# EasyEDA Pro project MA3050.eprj

# Schematic Schematic1
Create Date: 2024-05-30; Page Name: P1; Project Name: MA3050; Schematic Name: Schematic1; Update Date: 2024-06-02; Company: Just for fun; Drawed: GodGnidoc; Page Size: A4; Version: V1.2
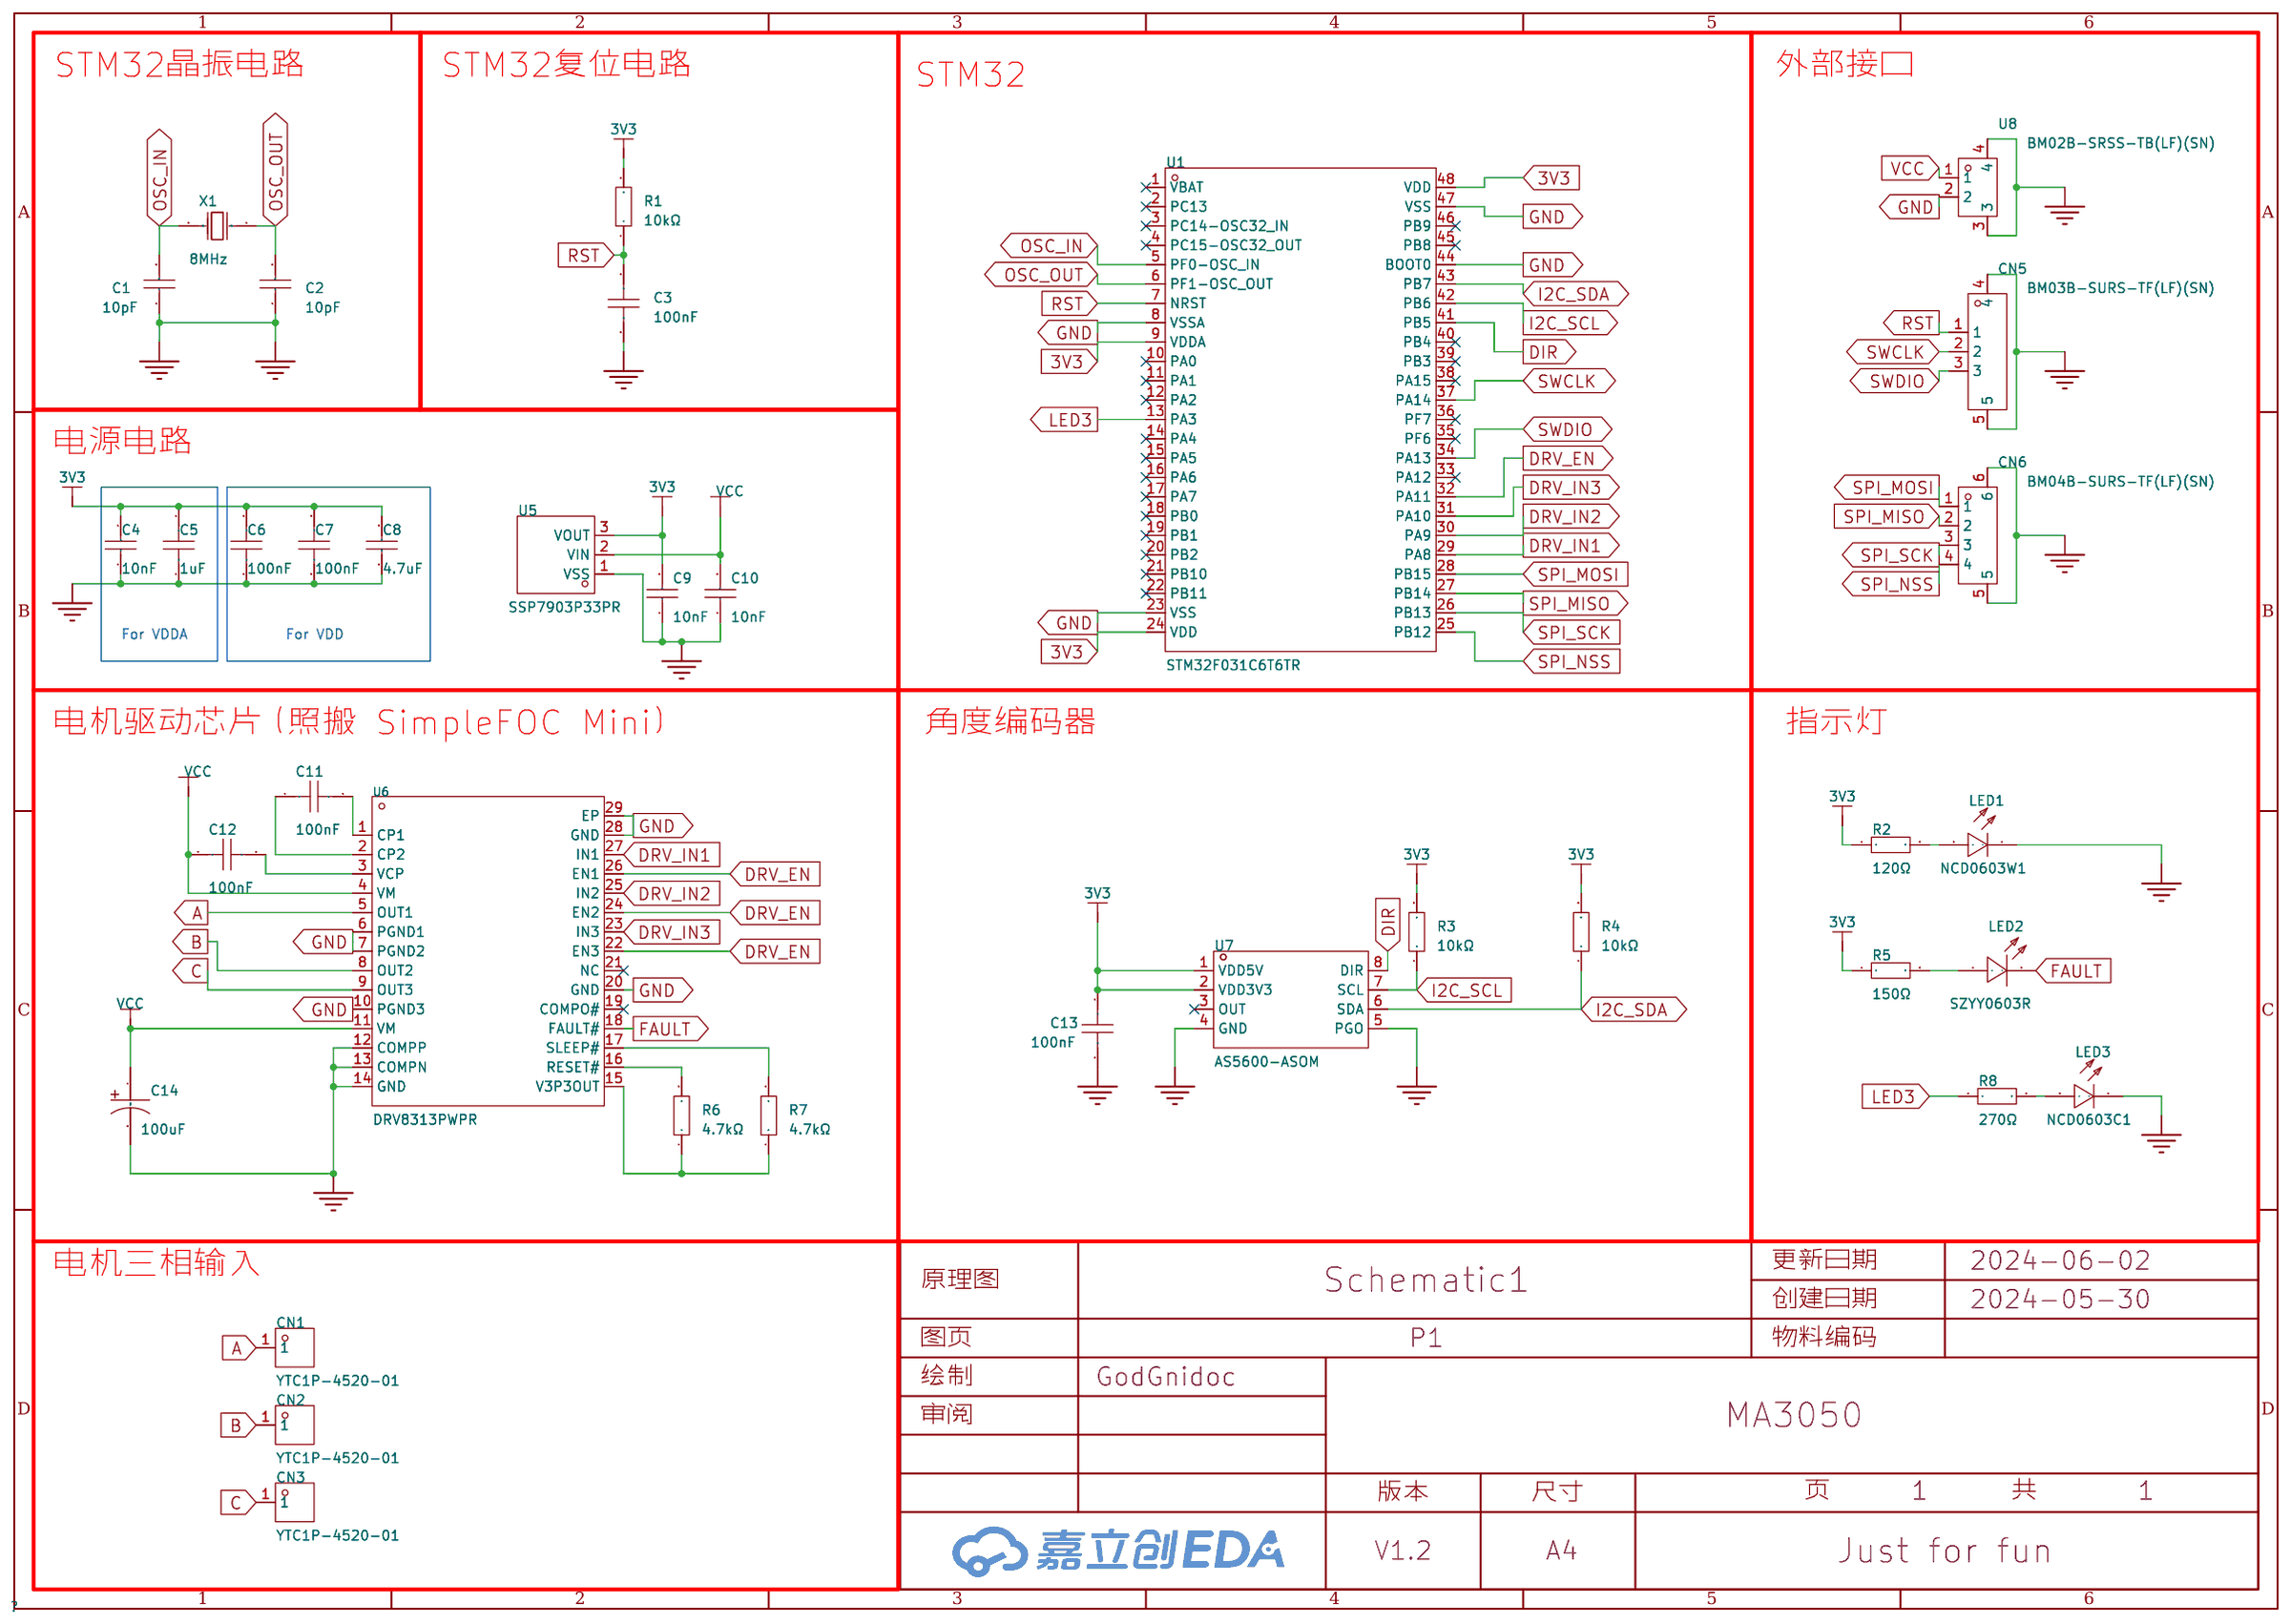
[diagram p0: schematic sheet]

## Parts
C1  10pF  [C0603]
C2  10pF  [C0603]
C3  100nF  [C0603]
C4  10nF  [C0603]
C5  1uF  [C0603]
C6  100nF  [C0603]
C7  100nF  [C0603]
C8  4.7uF  [C0603]
C9  10nF  [C0603]
C10  10nF  [C0603]
C11  100nF  [C0603]
C12  100nF  [C0603]
C13  100nF  [C0603]
C14  100uF  [CAP-SMD_BD6.3-L6.6-W6.6-FD]
CN1  YTC1P-4520-01  [TESTPOINT-SMD_BD2.0_YTC1P-4520-01]
CN2  YTC1P-4520-01  [TESTPOINT-SMD_BD2.0_YTC1P-4520-01]
CN3  YTC1P-4520-01  [TESTPOINT-SMD_BD2.0_YTC1P-4520-01]
CN5  BM03B-SURS-TF(LF)(SN)  [CONN-SMD_BM03B-SURS-TF]
CN6  BM04B-SURS-TF(LF)(SN)  [CONN-SMD_BM04B-SURS-TF-LF-SN]
LED1  NCD0603W1  [LED0603-RD]
LED2  SZYY0603R  [LED0603-R-RD]
LED3  NCD0603C1  [LED0603-RD]
R1  10kΩ  [R0603]
R2  120Ω  [R0603]
R3  10kΩ  [R0603]
R4  10kΩ  [R0603]
R5  150Ω  [R0603]
R6  4.7kΩ  [R0603]
R7  4.7kΩ  [R0603]
R8  270Ω  [R0603]
U1  STM32F031C6T6TR  [LQFP-48_L7.0-W7.0-P0.50-LS9.0-TL]
U5  SSP7903P33PR  [SOT-89-3_L4.5-W2.5-P1.50-LS4.1-BR]
U6  DRV8313PWPR  [HTSSOP-28_L9.8-W4.5-P0.65-LS6.6-BL-EP]
U7  AS5600-ASOM  [SOIC-8_L5.0-W4.0-P1.27-LS6.0-BL]
U8  BM02B-SRSS-TB(LF)(SN)  [CONN-TH_BM02B-SRSS-TB-LF-SN]
X1  8MHz  [CRYSTAL-SMD_L5.0-W3.2]

## Library data of the parts
C1 C2 = CL10C100JB8NNNC: 容值:10pF;精度:±5%;额定电压:50V;材质(温度系数):C0G;; LCSC Part Name: 10pF ±5% 50V; Supplier Part: C1634; Manufacturer: SAMSUNG(三星); Supplier Footprint: 0603; JLCPCB Part Class: 基础库; Datasheet: https://atta.szlcsc.com/upload/public/pdf/source/20160218/1457707763339.pdf; Supplier: LCSC; Tolerance: ±5%; Voltage Rated: 50V; Temperature Coefficient: C0G; Check: true
C3 C6 C7 C11-C13 = CL10B104KB8NNNC: 容值:100nF;精度:±10%;额定电压:50V;材质(温度系数):X7R;; LCSC Part Name: 100nF ±10% 50V; Supplier Part: C1591; Manufacturer: SAMSUNG(三星); Supplier Footprint: 0603; JLCPCB Part Class: Extended Part; Datasheet: https://atta.szlcsc.com/upload/public/pdf/source/20160218/1457707763339.pdf; Supplier: LCSC; Tolerance: ±10%; Voltage Rated: 50V; Temperature Coefficient: X7R; Check: true
C4 C9 C10 = CC0603KRX7R9BB103: 容值:10nF;精度:±10%;额定电压:50V;材质(温度系数):X7R;; LCSC Part Name: 10nF ±10% 50V; Supplier Part: C100042; Manufacturer: YAGEO(国巨); Supplier Footprint: 0603; JLCPCB Part Class: 扩展库; Datasheet: https://atta.szlcsc.com/upload/public/pdf/source/20181008/C309510_22F155564471FAF6A489F7D68F34234E.pdf; Supplier: LCSC; Tolerance: ±10%; Voltage Rated: 50V; Temperature Coefficient: X7R; Check: true
C5 = CL10A105KB8NNNC: 容值:1uF;精度:±10%;额定电压:50V;材质(温度系数):X5R;; LCSC Part Name: 1uF ±10% 50V; Supplier Part: C15849; Manufacturer: SAMSUNG(三星); Supplier Footprint: 0603; JLCPCB Part Class: 基础库; Datasheet: https://atta.szlcsc.com/upload/public/pdf/source/20160218/1457707763339.pdf; Supplier: LCSC; Tolerance: ±10%; Voltage Rated: 50V; Temperature Coefficient: X5R; Check: true
C8 = CL10A475KO8NNNC: 容值:4.7uF;精度:±10%;额定电压:16V;材质(温度系数):X5R;; LCSC Part Name: 4.7uF ±10% 16V; Supplier Part: C19666; Manufacturer: SAMSUNG(三星); Supplier Footprint: 0603; JLCPCB Part Class: 基础库; Datasheet: https://atta.szlcsc.com/upload/public/pdf/source/20160218/1457707763339.pdf; Supplier: LCSC; Tolerance: ±10%; Voltage Rated: 16V; Temperature Coefficient: X5R; Check: true
C14 = VT1V101M-CRE77: 容值:100uF;精度:±20%;额定电压:35V;纹波电流:-;等效串联电阻:-;; LCSC Part Name: 100uF ±20% 35V; Supplier Part: C294520; Manufacturer: VT(首科); Supplier Footprint: SMD,D6.3xL7.7mm; JLCPCB Part Class: 扩展库; Datasheet: https://atta.szlcsc.com/upload/public/pdf/source/20181029/C324063_620585B2DB5C8ABB183828EAB4CD59C7.pdf; Supplier: LCSC; Tolerance: ±20%; Rated Voltage: 35V; φD: 6.3mm; L: 7.7mm; Lifetime @ Temp: 1000hrs@105℃; Operating Temperature: -40℃~+105℃; Check: true
CN1-CN3 = YTC1P-4520-01: 类型:弹簧顶针(POGO PIN);PIN位数:单PIN位;全长/全高:6.5mm;额定电流:2.5A;额定电压:12V;触头材质:黄铜;触头镀层:金;; LCSC Part Name: POGO PIN弹簧顶针 贴片连接器; Supplier Part: C5221294; Manufacturer: YIYUAN(怡远); JLCPCB Part Class: 扩展库; Datasheet: https://atta.szlcsc.com/upload/public/pdf/source/20221031/BD070516233C1C93A35D01CFB419D0D5.pdf; Supplier: LCSC; Type: 弹簧顶针(POGO PIN); Number of Pins: 单PIN位; Overall Length/Height: 6.5mm; Rated Current: 2.5A; Rated Voltage: 12V; Contact Material: 黄铜; Contact Plating: 金; Check: true
CN5 = BM03B-SURS-TF(LF)(SN): 插针结构:1x3P;间距:0.8mm;安装方式:立贴;参考系列:-;总PIN数:3P;排数:1;每排PIN数:3;行距:-;额定电流:200mA;触头材质:铜合金;触头镀层:锡;工作温度范围:-25℃~+85℃;; LCSC Part Name: 1x3P 间距:0.8mm 立贴; Supplier Part: C594379; Manufacturer: JST; Supplier Footprint: SMD,P=0.8mm; JLCPCB Part Class: 扩展库; Datasheet: https://atta.szlcsc.com/upload/public/pdf/source/20211104/F9E1F8CA9D999D7845259FE213F9F750.pdf; Supplier: LCSC; Pins Structure: 1x3P; Pitch: 0.8mm; Mounting Style: 立贴; Number of Pins: 3P; Number of Rows: 1; Number of PINs Per Row: 3; Current Rating (Max): 200mA; Contact Material: 铜合金; Contact Plating: 锡; Operating Temperature Range: -25℃~+85℃
CN6 = BM04B-SURS-TF(LF)(SN): 插针结构:1x4P;间距:0.8mm;安装方式:立贴;参考系列:-;总PIN数:4P;排数:1;每排PIN数:4;行距:-;额定电流:200mA;触头材质:铜合金;触头镀层:锡;工作温度范围:-25℃~+85℃;; LCSC Part Name: 1x4P 间距:0.8mm 立贴; Supplier Part: C495551; Manufacturer: JST; Supplier Footprint: SMD,P=0.8mm; JLCPCB Part Class: Extended Part; Datasheet: https://atta.szlcsc.com/upload/public/pdf/source/20200407/C495551_4ACF452D9BF553EDABEE027727395083.pdf; Supplier: LCSC; Pins Structure: 1x4P; Pitch: 0.8mm; Mounting Style: 立贴; Number of Pins: 4P; Number of Rows: 1; Number of PINs Per Row: 4; Current Rating (Max): 200mA; Contact Material: 铜合金; Contact Plating: 锡; Operating Temperature Range: -25℃~+85℃
LED1 = NCD0603W1: 发光颜色:白色;正向电压(VF):2.6V~3.6V;功率:72mW;正向电流:5mA;透镜颜色:雾状黄透镜;发光强度:200mcd~300mcd;发光角度:130°;工作温度:-30℃~+85℃;; Supplier Part: C84265; Manufacturer: 国星光电; Supplier Footprint: 0603; JLCPCB Part Class: 扩展库; Datasheet: https://atta.szlcsc.com/upload/public/pdf/source/20200820/C84265_479E6193713348A548E5CD6D9278BF16.pdf; Supplier: LCSC; Emitted Color: 白色; Forward Voltage (VF): 2.6V~3.6V; Power Dissipation: 72mW; Forward Current: 5mA; Lens Color: 雾状黄透镜; Luminous Intensity: 200mcd~300mcd; Viewing Angle: 130°; Operating Temperature: -30℃~+85℃; Check: true
LED2 = SZYY0603R: 发光颜色:红色;功率:40mW;正向电流:20mA;主波长:615nm~630nm;二极管配置:-;透镜颜色:无色透明透镜;色温:-;发光角度:120°;载带方式:-;工作温度:-40℃~+85℃;; LCSC Part Name: 红灯; Supplier Part: C434419; Manufacturer: yongyu(永裕光电); Supplier Footprint: 0603; JLCPCB Part Class: 扩展库; Datasheet: https://atta.szlcsc.com/upload/public/pdf/source/20191204/C434419_0B955C1F73FF88449D9A795B6FF49070.pdf; Supplier: LCSC; Emitted Color: 红色; Power Dissipation: 40mW; Forward Current: 20mA; Dominant Wavelength: 615nm~630nm; Peak Wavelength: 645nm; Lens Color: 无色透明透镜; Viewing Angle: 120°; Operating Temperature: -40℃~+85℃; Check: true
LED3 = NCD0603C1: 发光颜色:黄绿色;正向电压(VF):1.6V~2.6V;功率:65mW;正向电流:5mA;主波长:565nm~578nm;透镜颜色:无色透明透镜;发光强度:5mcd~13mcd;发光角度:140°;工作温度:-30℃~+85℃;; Supplier Part: C84264; Manufacturer: 国星光电; Supplier Footprint: 0603; JLCPCB Part Class: 扩展库; Datasheet: https://atta.szlcsc.com/upload/public/pdf/source/20200820/C84264_94B2FEF0C4ADFC9200EBC3AD62A401B4.pdf; Supplier: LCSC; Emitted Color: 黄绿色; Forward Voltage (VF): 1.6V~2.6V; Power Dissipation: 65mW; Forward Current: 5mA; Dominant Wavelength: 565nm~578nm; Lens Color: 无色透明透镜; Luminous Intensity: 5mcd~13mcd; Viewing Angle: 140°; Operating Temperature: -30℃~+85℃; Check: true
R1 R3 R4 = 0603WAF1002T5E: 电阻类型:厚膜电阻;阻值:10kΩ;精度:±1%;功率:100mW;最大工作电压:75V;温度系数:±100ppm/℃;; LCSC Part Name: 厚膜电阻 10kΩ ±1% 100mW; Supplier Part: C25804; Manufacturer: UNI-ROYAL(厚声); Supplier Footprint: 0603; JLCPCB Part Class: 基础库; Datasheet: https://atta.szlcsc.com/upload/public/pdf/source/20200306/C422600_1E6D84923E4A46A82E41ADD87F860B5C.pdf; Supplier: LCSC; Type: 厚膜电阻; Tolerance: ±1%; Power(Watts): 100mW; Overload Voltage (Max): 75V; Temperature Coefficient: ±100ppm/℃; Operating Temperature Range: -55℃~+155℃; Check: true
R2 = 0603WAF1200T5E: 电阻类型:厚膜电阻;阻值:120Ω;精度:±1%;功率:100mW;最大工作电压:75V;温度系数:±100ppm/℃;; LCSC Part Name: 120Ω ±1% 100mW 厚膜电阻; Supplier Part: C22787; Manufacturer: UNI-ROYAL(厚声); Supplier Footprint: 0603; JLCPCB Part Class: 基础库; Datasheet: https://atta.szlcsc.com/upload/public/pdf/source/20200306/C422600_1E6D84923E4A46A82E41ADD87F860B5C.pdf; Supplier: LCSC; Type: 厚膜电阻; Tolerance: ±1%; Power(Watts): 100mW; Overload Voltage (Max): 75V; Temperature Coefficient: ±100ppm/℃; Operating Temperature Range: -55℃~+155℃; Check: true
R5 = 0603WAF1500T5E: 电阻类型:厚膜电阻;阻值:150Ω;精度:±1%;功率:100mW;最大工作电压:75V;温度系数:±100ppm/℃;; LCSC Part Name: 150Ω ±1% 100mW 厚膜电阻; Supplier Part: C22808; Manufacturer: UNI-ROYAL(厚声); Supplier Footprint: 0603; JLCPCB Part Class: 基础库; Datasheet: https://atta.szlcsc.com/upload/public/pdf/source/20200306/C422600_1E6D84923E4A46A82E41ADD87F860B5C.pdf; Supplier: LCSC; Type: 厚膜电阻; Tolerance: ±1%; Power(Watts): 100mW; Overload Voltage (Max): 75V; Temperature Coefficient: ±100ppm/℃; Operating Temperature Range: -55℃~+155℃; Check: true
R6 R7 = 0603WAF4701T5E: 电阻类型:厚膜电阻;阻值:4.7kΩ;精度:±1%;功率:100mW;最大工作电压:75V;温度系数:±100ppm/℃;; LCSC Part Name: 4.7kΩ ±1% 100mW 厚膜电阻; Supplier Part: C23162; Manufacturer: UNI-ROYAL(厚声); Supplier Footprint: 0603; JLCPCB Part Class: 基础库; Datasheet: https://atta.szlcsc.com/upload/public/pdf/source/20200306/C422600_1E6D84923E4A46A82E41ADD87F860B5C.pdf; Supplier: LCSC; Type: 厚膜电阻; Tolerance: ±1%; Power(Watts): 100mW; Overload Voltage (Max): 75V; Temperature Coefficient: ±100ppm/℃; Operating Temperature Range: -55℃~+155℃; Check: true
R8 = 0603WAF2700T5E: 电阻类型:厚膜电阻;阻值:270Ω;精度:±1%;功率:100mW;最大工作电压:75V;温度系数:±100ppm/℃;; LCSC Part Name: 270Ω ±1% 100mW 厚膜电阻; Supplier Part: C22966; Manufacturer: UNI-ROYAL(厚声); Supplier Footprint: 0603; JLCPCB Part Class: 基础库; Datasheet: https://atta.szlcsc.com/upload/public/pdf/source/20200306/C422600_1E6D84923E4A46A82E41ADD87F860B5C.pdf; Supplier: LCSC; Type: 厚膜电阻; Tolerance: ±1%; Power(Watts): 100mW; Overload Voltage (Max): 75V; Temperature Coefficient: ±100ppm/℃; Operating Temperature Range: -55℃~+155℃; Check: true
U1 = STM32F031C6T6TR: CPU内核:CM0;程序存储容量:32KB;RAM总容量:4KB;GPIO端口数量:39;工作电压范围:2V~3.6V;CPU最大主频:48MHz;程序存储器类型:FLASH;; Supplier Part: C329281; Manufacturer: ST(意法半导体); Supplier Footprint: LQFP-48(7x7); JLCPCB Part Class: 扩展库; Datasheet: https://atta.szlcsc.com/upload/public/pdf/source/20200115/C329281_BA1E970E2AF70B7E7E25D04A5194356F.pdf; Supplier: LCSC; CPU Core: CM0; Program Storage Size: 32KB; RAM Size: 4KB; GPIO Ports Number: 39; Operating Voltage Range: 2V~3.6V; CPU Maximum Speed: 48MHz; Program Memory Type: FLASH; Operating Temperature Range: -40℃~+85℃; ADC (Bit): 12bit; Peripheral/Function: DMA；PWM; Watchdog: 有; Infrared Data Association: 有; Low-Voltage Detect: 有; Direct Memory Access: 有; Internal Oscillator: 有; Check: true
U5 = SSP7903P33PR: 最大输入电压:40V;输出电压:3.3V;最大输出电流:1A;电源纹波抑制比(PSRR):73.2dB@(10Hz);输出极性:正极;; Supplier Part: C2965586; Manufacturer: Siproin(上海矽朋); Supplier Footprint: SOT-89-3; JLCPCB Part Class: 扩展库; Datasheet: https://atta.szlcsc.com/upload/public/pdf/source/20231026/C9DC5668D914F4F12A37EC04B80DC6E1.pdf; Supplier: LCSC; Maximum Input Voltage: 40V; Output Voltage: 3.3V; MAX Output Current: 1A; Power Supply Rejection Ratio (PSRR): 73.2dB@(10Hz); Dropout Voltage: 20mV; standby current: 1.6uA; Operating Temperature: -40℃~+85℃; Output Polarity: 正极; Number of Outputs: 1; Check: true
U6 = DRV8313PWPR: 驱动电机类型:无刷直流BLDC;电源电压:8V~60V;输出电流:-;接口:并行;; LCSC Part Name: 无刷直流BLDC电机驱动芯片 60V; Supplier Part: C92482; Manufacturer: TI(德州仪器); Supplier Footprint: HTSSOP-28-EP-4.5mm; JLCPCB Part Class: 扩展库; Datasheet: https://www.ti.com/cn/lit/gpn/drv8313; Supplier: LCSC; Drive motor type: 无刷直流BLDC; Supply Voltage: 8V~60V; Interface: 并行; Operating Temperature: -40℃~+150℃@(Tj); Check: true
U7 = AS5600-ASOM: 旋转角度范围:0°~360°;; Supplier Part: C79815; Manufacturer: ams(艾迈斯半导体); Supplier Footprint: SOIC-8; JLCPCB Part Class: 扩展库; Datasheet: https://atta.szlcsc.com/upload/public/pdf/source/20161027/1477535527192.pdf; Supplier: LCSC; Supply Voltage: 5V；3.3V; Rotation Angle: 0°~360°; Check: true
U8 = BM02B-SRSS-TB(LF)(SN): 插针结构:1x2P;间距:1mm;安装方式:立贴;参考系列:SH;总PIN数:2P;排数:1;每排PIN数:2;行距:-;额定电流:1A;触头材质:铜合金;触头镀层:锡;工作温度范围:-25℃~+85℃;; LCSC Part Name: 1x2P 间距:1mm 立贴 系列:SH; Supplier Part: C160388; Manufacturer: JST; Supplier Footprint: SMD,P=1mm; JLCPCB Part Class: Extended Part; Datasheet: https://atta.szlcsc.com/upload/public/pdf/source/20181008/C268118_5C0FE2784716D1E5DD0A36233D1E1F34.pdf; Supplier: LCSC; Pins Structure: 1x2P; Pitch: 1mm; Mounting Style: 立贴; Reference Series: SH; Number of Pins: 2P; Number of Rows: 1; Number of PINs Per Row: 2; Current Rating (Max): 1A; Contact Material: 铜合金; Contact Plating: 锡; Operating Temperature Range: -25℃~+85℃; Rated Voltage (Max): 50V; Plastic Material: PA; Flame Retardant Rating: UL94V-0; Z-Height of the Board: 4.25mm; X-Length of Bottom Edge on Board (Spacing Line): 4mm; Y-Width of Bottom Edge on Board: 3.6mm
X1 = X50328MSB2GI: 晶振类型:贴片晶振;频率:8MHz;常温频差:±10ppm;外接负载电容:20pF;频率稳定度(全温):±20ppm;; LCSC Part Name: 8MHz ±10ppm 20pF YSX530GA; Supplier Part: C115962; Manufacturer: YXC(扬兴晶振); Supplier Footprint: SMD5032; JLCPCB Part Class: 基础库; Datasheet: https://atta.szlcsc.com/upload/public/pdf/source/20240329/44922B0AF7B60E58E9B66993B6077277.pdf; Supplier: LCSC; Crystal Type: 贴片晶振; Normal temperature Frequency Tolerance: ±10ppm; External load capacitor: 20pF; Frequency Stability(Full temperature range): ±20ppm; Operating Temperature: -40℃~+85℃; Check: true

## Nets
3V3: C4.2 C5.2 C6.2 C7.2 C8.2 C9.2 C13.1 R1.2 R2.1 R3.2 R4.2 R5.1 U1.9(VDDA) U1.24(VDD) U1.48(VDD) U5.3(VOUT) U7.1(VDD5V) U7.2(VDD3V3)
GND: C1.1 C2.1 C3.1 C4.1 C5.1 C6.1 C7.1 C8.1 C9.1 C10.1 C13.2 C14.2 CN5.4 CN5.5 CN6.5 CN6.6 LED1.1(-) LED3.1(-) U1.8(VSSA) U1.23(VSS) U1.44(BOOT0) U1.47(VSS) U5.1(VSS) U6.6(PGND1) U6.7(PGND2) U6.10(PGND3) U6.12(COMPP) U6.13(COMPN) U6.14(GND) U6.20(GND) U6.28(GND) U6.29(EP) U7.4(GND) U7.5(PGO) U8.2 U8.3 U8.4
VCC: C10.2 C12.1 C14.1 U5.2(VIN) U6.4(VM) U6.11(VM) U8.1
A: CN1.1 U6.5(OUT1)
B: CN2.1 U6.8(OUT2)
C: CN3.1 U6.9(OUT3)
DIR: U1.41(PB5) U7.8(DIR)
DRV_EN: U1.32(PA11) U6.22(EN3) U6.24(EN2) U6.26(EN1)
DRV_IN1: U1.29(PA8) U6.27(IN1)
DRV_IN2: U1.30(PA9) U6.25(IN2)
DRV_IN3: U1.31(PA10) U6.23(IN3)
FAULT: LED2.2(-) U6.18(FAULT#)
I2C_SCL: R3.1 U1.42(PB6) U7.7(SCL)
I2C_SDA: R4.1 U1.43(PB7) U7.6(SDA)
LED3: R8.1 U1.13(PA3)
OSC_IN: C1.2 U1.5(PF0-OSC_IN) X1.2(OSC2)
OSC_OUT: C2.2 U1.6(PF1-OSC_OUT) X1.1(OSC1)
RST: C3.2 CN5.1 R1.1 U1.7(NRST)
SPI_MISO: CN6.2 U1.27(PB14)
SPI_MOSI: CN6.1 U1.28(PB15)
SPI_NSS: CN6.4 U1.25(PB12)
SPI_SCK: CN6.3 U1.26(PB13)
SWCLK: CN5.2 U1.37(PA14)
SWDIO: CN5.3 U1.34(PA13)
$1N1736: C11.2 U6.1(CP1)
$1N1740: C11.1 U6.2(CP2)
$1N1864: C12.2 U6.3(VCP)
$1N2389: R6.1 R7.1 U6.15(V3P3OUT)
$1N2553: R6.2 U6.16(RESET#)
$1N2568: R7.2 U6.17(SLEEP#)
$1N10555: LED1.2(+) R2.2
$1N10742: LED2.1(+) R5.2
$1N10752: LED3.2(+) R8.2

Not connected (* = marked no-connect by the designer): U1 1(VBAT)* 2(PC13)* 3(PC14-OSC32_IN)* 4(PC15-OSC32_OUT)* 10(PA0)* 11(PA1)* 12(PA2)* 14(PA4)* 15(PA5)* 16(PA6)* 17(PA7)* 18(PB0)* 19(PB1)* 20(PB2)* 21(PB10)* 22(PB11)* 33(PA12)* 35(PF6)* 36(PF7)* 38(PA15)* 39(PB3)* 40(PB4)* 45(PB8)* 46(PB9)*; U6 19(COMPO#)* 21(NC)*; U7 3(OUT)*

## Notes on the sheet
- STM32晶振电路
- STM32复位电路
- STM32
- 外部接口
- 电源电路
- For VDDA
- For VDD
- 电机驱动芯片（照搬 SimpleFOC Mini）
- 角度编码器
- 指示灯
- 电机三相输入

# Board PCB1
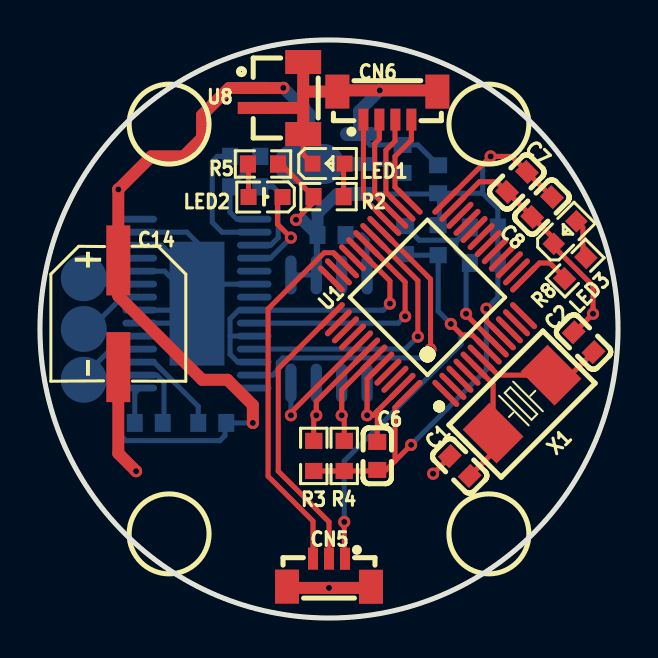
[diagram p1: board, top side]
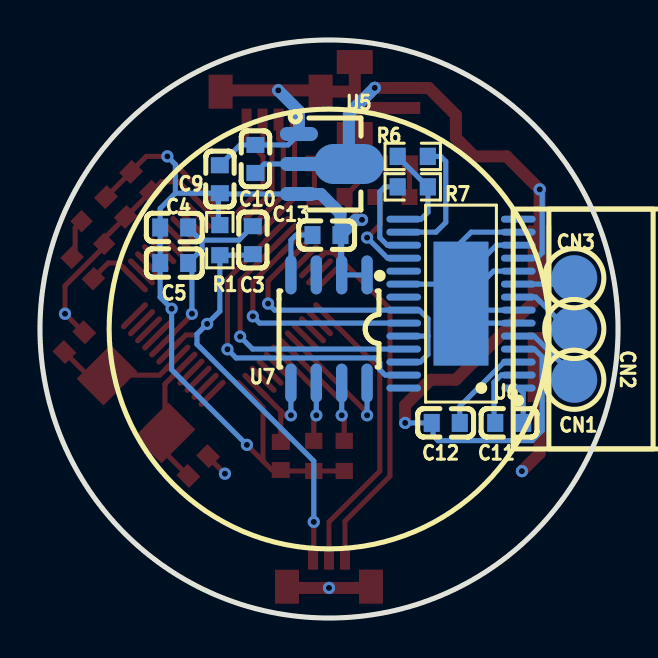
[diagram p2: board, bottom side, seen from below]

Outline 28.92 x 28.92 mm; copper layers: Top Layer, Bottom Layer. Coordinates in mm from the lower left corner of the outline.
Outline path: circle c14.46,14.46 r14.46
Stack: Top Layer 0.035mm / Dielectric1 1.51mm FR4 er 4.5 / Bottom Layer 0.035mm

## Design rules (mm)
net OSC_IN: DP1
net OSC_OUT: DP1
template: JLCPCB Capability(Two Layers Board)
spacing copperThickness1oz (default): track to track 0.102, other pairs 0.152 to 0.3
spacing copperThickness2oz: track to track 0.203, other pairs 0.152 to 0.3
track width copperThickness1oz (default): min 0.127, default 0.254, max 2.54
track width copperThickness2oz: min 0.203, default 0.254, max 2.54
differential pair differentialPair (default): width min 0.127, default 0.254, max 2.54; gap min 0.152, default 0.152
via viaSize (default): diameter min 0.5, default 0.61, max 10; hole min 0.3, default 0.305, max 6.3

## Placement (name value [footprint] x y rotation side)
C1  10pF  [C0603]  21 7.6 315 top
C2  10pF  [C0603]  27.2 13.8 315 top
C3  100nF  [C0603]  18.27 18.91 270 bottom
C4  10nF  [C0603]  22.21 19.54 0 bottom
C5  1uF  [C0603]  22.21 17.76 0 bottom
C6  100nF  [C0603]  16.87 8.11 270 top
C7  100nF  [C0603]  23.86 21.82 45 top
C8  4.7uF  [C0603]  25.12 20.56 45 top
C9  10nF  [C0603]  19.92 21.95 270 bottom
C10  10nF  [C0603]  18.14 22.97 270 bottom
C11  100nF  [C0603]  5.44 9.76 180 bottom
C12  100nF  [C0603]  8.62 9.76 180 bottom
C13  100nF  [C0603]  14.59 19.16 0 bottom
C14  100uF  [CAP-SMD_BD6.3-L6.6-W6.6-FD]  3.92 15.22 270 top
CN1  YTC1P-4520-01  [TESTPOINT-SMD_BD2.0_YTC1P-4520-01]  2.19 11.92 0 bottom
CN2  YTC1P-4520-01  [TESTPOINT-SMD_BD2.0_YTC1P-4520-01]  2.19 14.46 0 bottom
CN3  YTC1P-4520-01  [TESTPOINT-SMD_BD2.0_YTC1P-4520-01]  2.19 17 0 bottom
CN5  BM03B-SURS-TF(LF)(SN)  [CONN-SMD_BM03B-SURS-TF]  14.46 2.27 0 top
CN6  BM04B-SURS-TF(LF)(SN)  [CONN-SMD_BM04B-SURS-TF-LF-SN]  17.38 25.64 0 top
LED1  NCD0603W1  [LED0603-RD]  14.44 22.73 0 top
LED2  SZYY0603R  [LED0603-R-RD]  11.28 21.06 180 top
LED3  NCD0603C1  [LED0603-RD]  26.27 19.29 45 top
R1  10kΩ  [R0603]  19.92 18.91 90 bottom
R2  120Ω  [R0603]  14.44 21.08 0 top
R3  10kΩ  [R0603]  13.7 8.11 270 top
R4  10kΩ  [R0603]  15.22 8.11 270 top
R5  150Ω  [R0603]  11.16 22.72 180 top
R6  4.7kΩ  [R0603]  10.27 23.1 180 bottom
R7  4.7kΩ  [R0603]  10.27 21.57 0 bottom
R8  270Ω  [R0603]  26.78 17.51 45 top
U1  STM32F031C6T6TR  [lqfp-48_l7.0-w7.0-p0.50-ls9.0-tl]  19.39 16.05 135 top
U5  SSP7903P33PR  [SOT-89-3_L4.5-W2.5-P1.50-LS4.1-BR]  14.71 22.72 0 bottom
U6  DRV8313PWPR  [HTSSOP-28_L9.8-W4.5-P0.65-LS6.6-BL-EP]  7.86 15.73 90 bottom
U7  AS5600-ASOM  [SOIC-8_L5.0-W4.0-P1.27-LS6.0-BL]  14.46 14.46 0 bottom
U8  BM02B-SRSS-TB(LF)(SN)  [CONN-TH_BM02B-SRSS-TB-LF-SN]  11.92 26.02 90 top
X1  8MHz  [CRYSTAL-SMD_L5.0-W3.2]  24.12 10.7 225 top

## Footprints (pads in the part's own frame, mm; a bottom-side part is the same pattern mirrored in y, then rotated)
C0603
  rect 0.8x0.9 smd: 1(-0.7,0) 2(0.7,0)
CAP-SMD_BD6.3-L6.6-W6.6-FD
  rect 3.5x1.2 smd: 1(-2.67,0) 2(2.67,0)
CONN-SMD_BM03B-SURS-TF
  rect 0.5x1.1 smd: 1(0.799,0.699) 2(-0.001,0.702) 3(-0.8,0.702)
  rect 1.2x1.7 smd: 4(-2.1,-0.699) 5(2.1,-0.702)
CONN-SMD_BM04B-SURS-TF-LF-SN
  rect 0.5x1.1 smd: 1(-1.2,-0.699) 2(-0.4,-0.702) 3(0.401,-0.702) 4(1.201,-0.702)
  rect 1.2x1.7 smd: 5(2.501,0.699) 6(-2.501,0.702)
CONN-TH_BM02B-SRSS-TB-LF-SN
  rect 0.6x1.55 smd: 1(0.502,1.25) 2(-0.498,1.25)
  rect 1.2x1.8 smd: 3(1.8,-1.25) 4(-1.8,-1.25)
CRYSTAL-SMD_L5.0-W3.2
  rect 1.9x2.4 smd: 1(-2.05,0) 2(2.05,0)
HTSSOP-28_L9.8-W4.5-P0.65-LS6.6-BL-EP
  oval 0.343x1.732 smd: 1(-4.225,-2.866) 2(-3.575,-2.866) 3(-2.925,-2.866) 4(-2.275,-2.866) 5(-1.625,-2.866) 6(-0.975,-2.866) 7(-0.325,-2.866) 8(0.325,-2.866) 9(0.975,-2.866) 10(1.625,-2.866) 11(2.275,-2.866) 12(2.925,-2.866) 13(3.575,-2.866) 14(4.225,-2.866) 15(4.225,2.866) 16(3.575,2.866) 17(2.925,2.866) 18(2.275,2.866) 19(1.625,2.866) 20(0.975,2.866) 21(0.325,2.866) 22(-0.325,2.866) 23(-0.975,2.866) 24(-1.625,2.866) 25(-2.275,2.866) 26(-2.925,2.866) 27(-3.575,2.866) 28(-4.225,2.866)
  rect 6.2x2.75 smd: 29(0,0)
LED0603-R-RD
  rect 0.8x0.8 smd: 1(0.851,0) 2(-0.851,0)
LED0603-RD
  rect 0.8x0.8 smd: 1(-0.799,0) 2(0.799,0)
lqfp-48_l7.0-w7.0-p0.50-ls9.0-tl
  oval 1.8x0.28 smd: 1(-4.05,2.75) 2(-4.05,2.25) 3(-4.05,1.75) 4(-4.05,1.25) 5(-4.05,0.75) 6(-4.05,0.25) 7(-4.05,-0.25) 8(-4.05,-0.75) 9(-4.05,-1.25) 10(-4.05,-1.75) 11(-4.05,-2.25) 12(-4.05,-2.75) 25(4.05,-2.75) 26(4.05,-2.25) 27(4.05,-1.75) 28(4.05,-1.25) 29(4.05,-0.75) 30(4.05,-0.25) 31(4.05,0.25) 32(4.05,0.75) 33(4.05,1.25) 34(4.05,1.75) 35(4.05,2.25) 36(4.05,2.75)
  oval 0.28x1.8 smd: 13(-2.75,-4.05) 14(-2.25,-4.05) 15(-1.75,-4.05) 16(-1.25,-4.05) 17(-0.75,-4.05) 18(-0.25,-4.05) 19(0.25,-4.05) 20(0.75,-4.05) 21(1.25,-4.05) 22(1.75,-4.05) 23(2.25,-4.05) 24(2.75,-4.05) 37(2.75,4.05) 38(2.25,4.05) 39(1.75,4.05) 40(1.25,4.05) 41(0.75,4.05) 42(0.25,4.05) 43(-0.25,4.05) 44(-0.75,4.05) 45(-1.25,4.05) 46(-1.75,4.05) 47(-2.25,4.05) 48(-2.75,4.05)
R0603
  rect 0.806x0.864 smd: 1(-0.753,0) 2(0.753,0)
SOIC-8_L5.0-W4.0-P1.27-LS6.0-BL
  oval 0.569x1.95 smd: 1(-1.905,-2.705) 2(-0.635,-2.705) 3(0.635,-2.705) 4(1.905,-2.705) 5(1.905,2.705) 6(0.635,2.705) 7(-0.635,2.705) 8(-1.905,2.705)
SOT-89-3_L4.5-W2.5-P1.50-LS4.1-BR
  oval 1.9x0.7 smd: 1(1.25,-1.501) 3(1.25,1.501)
  oval 3.5x2 smd: 2(-1.25,0)
  oval 2.1x0.7 smd: 2(1.151,0)
TESTPOINT-SMD_BD2.0_YTC1P-4520-01
  round 2.3 smd: 1(0,0)

## Nets
As in the schematic.

Pads without a net: U1 1 2 3 4 10 11 12 14 15 16 17 18 19 20 21 22 33 35 36 38 39 40 45 46; U6 19 21; U7 3

## Via types
v1: diameter 0.61, hole 0.305, Top Layer to Bottom Layer, 24 vias

## Routing (per net, layer and track width the routed paths; a pad name or vN(x,y) marks a point on that pad's centre or on a via; arc(x,y) is an arc through that point)
3V3: length 56.8
  Top Layer w0.254: R5.1 12.05,22.72 R2.1 13.68,20.8 v1(12.81,19.92) ; v1(22.33,15.48) 22.33,14.87 U1.9 ; R3.2 R4.2 16.82,7.36 C6.2 17.32,7.41 17.76,7.86 ; 17.76,7.86 17.76,10.53 U1.48 ; 17.76,7.86 v1(18.57,8.66) ; U1.24 v1(22.55,23.1) 23.6,23.1 24.36,22.34 C7.2 C8.2
  Bottom Layer w0.254: U5.3 19.88,21.21 C9.2 ; 22.15,21.25 C9.2 ; 22.15,21.25 22.15,22.69 v1(22.55,23.1) ; 22.15,21.25 22.91,20.49 C4.2 C5.2 22.91,16.05 v1(22.33,15.48) 22.33,12.43 v1(18.57,8.66) ; C9.2 19.99,21.18 19.99,19.66 R1.2 ; U7.2 U7.1 ; U7.2 13.89,17.17 C13.1 13.83,19.1 U7.2
  Bottom Layer w0.6: U5.3 14.86,21.21 13.89,20.24 C13.1 13.12,19.92 v1(12.81,19.92)
GND: length 88.9
  Top Layer w0.254: 16.87,10.35 C6.1 ; 16.87,10.35 U1.47 ; 16.87,10.35 16.66,10.14 v1(16.37,10.14) 16.37,11.96 U1.44 ; U1.8 21.32,15.17 v1(21.32,15.22) ; U1.23 21.98,21.83 22.84,21.83 23.34,21.32 C7.1 C8.1 25.71,18.99 LED3.1 25.71,18.58 27.67,16.62 v1(27.67,15.22) 26.74,14.3 C2.1 ; 13.64,22.86 13.51,22.86 13.17,23.2 ; v1(19.67,7.22) 20.51,8.06 C1.1 ; U8.4 13.17,23.33
  Top Layer w0.6: CN5.4 12.42,1.51 v1(14.46,1.51) 16.5,1.51 CN5.5 ; U8.4 13.17,25.65 ; 13.17,25.65 13.04,25.52 U8.2 ; 13.17,25.65 13.17,26.34 ; C14.2 3.92,8.24 v1(4.81,7.35) ; U8.3 13.17,26.34 ; 13.17,26.34 CN6.6 14.94,26.4 v1(17,26.4) 19.82,26.4 CN6.5
  Bottom Layer w0.254: 7.86,16.88 U6.29 ; 7.86,16.88 7.86,18.8 7.35,19.31 U6.13 ; 7.86,16.88 6.08,18.66 U6.12 ; U6.29 8.83,16.71 U6.20 ; U6.29 6.23,17.36 U6.10 ; U6.29 7.53,15.41 ; U6.6 6.88,14.76 7.36,15.23 7.53,15.41 ; C13.2 16.11,19.16 16.37,18.91 U7.4 ; U5.1 16.51,23.67 C10.1 18.91,23.67 C9.1 ; 20.87,18.91 C4.1 ; 20.87,18.91 18.97,18.91 C3.1 ; 20.87,18.91 20.81,18.84 20.81,18.46 C5.1 21.32,17.57 v1(21.32,15.22) ; U6.7 7.53,15.41 ; U7.5 v1(16.37,10.14)
  Bottom Layer w0.6: v1(17,26.4) 15.96,25.36 U5.1
VCC: length 50.4
  Top Layer w0.6: v1(10.65,9.76) 10.65,10.65 9.38,11.92 8.11,11.92 3.92,16.12 C14.1 v1(3.92,21.45) 5.57,23.1 7.19,23.1 8.11,24.02 8.11,25.16 9.47,26.52 U8.1 12.17,26.52 v1(12.17,26.53)
  Bottom Layer w0.254: C10.2 17.7,22.72 U5.2 ; U6.11 4.06,18.01 3.79,18.27 3.79,21.32 v1(3.92,21.45) ; v1(10.65,9.76) C12.1 9.25,9.7 9.25,9.13 9,8.87 4.3,8.87 3.79,9.38 3.79,13.06 4.18,13.46 4.99,13.46
  Bottom Layer w0.6: U5.2 13.46,25.23 v1(12.17,26.53)
A: length 3.8
  Bottom Layer w0.254: U6.5 4.2,14.11 2.19,12.1 CN1.1
B: length 3.5
  Bottom Layer w0.254: U6.8 4.12,16.06 2.52,14.46 CN2.1
C: length 2.9
  Bottom Layer w0.254: CN3.1 2.49,16.71 U6.9
DIR: length 6.6
  Top Layer w0.254: U1.41 12.56,10.28 v1(12.56,10.14)
  Bottom Layer w0.254: v1(12.56,10.14) U7.8
DRV_EN: length 16
  Top Layer w0.254: U1.32 17.51,16.86 v1(17.51,15.73)
  Bottom Layer w0.254: 9.51,14.11 9.51,13.19 9.9,12.81 U6.26 ; 9.51,14.11 9.51,14.97 9.94,15.41 U6.22 17.18,15.41 v1(17.51,15.73) ; 9.51,14.11 9.52,14.11 U6.24
DRV_IN1: length 16.6
  Top Layer w0.254: v1(19.54,13.44) 19.54,16.95 U1.29
  Bottom Layer w0.254: v1(19.54,13.44) 19.11,13.01 12.15,13.01 11.92,12.79 11.92,12.43 11.65,12.16 U6.27
DRV_IN2: length 14.4
  Top Layer w0.254: v1(18.91,14.08) 18.91,16.88 U1.30
  Bottom Layer w0.254: 10.72,13.46 18.28,13.46 v1(18.91,14.08)
DRV_IN3: length 12.1
  Top Layer w0.254: v1(18.27,15.1) 18.27,16.81 16.34,18.73
  Bottom Layer w0.254: v1(18.27,15.1) 17.93,14.76 U6.23
FAULT: length 4.7
  Top Layer w0.254: v1(12.56,19.03) 11.88,19.71 11.88,20.81 LED2.2
  Bottom Layer w0.254: v1(12.56,19.03) 11.53,18.01 U6.18
I2C_SCL: length 7.2
  Top Layer w0.254: 16.34,13.36 13.83,10.84 v1(13.83,10.14) 13.7,10.02 R3.1
  Bottom Layer w0.254: v1(13.83,10.14) U7.7
I2C_SDA: length 6.5
  Top Layer w0.254: R4.1 15.22,10.02 v1(15.09,10.14) 15.09,11.4 U1.43
  Bottom Layer w0.254: v1(15.09,10.14) U7.6
LED3: length 2.7
  Top Layer w0.254: R8.1 26.25,17.02 25.51,17.76 24.99,17.76 24.19,16.97
OSC_IN: length 6.4
  Top Layer w0.254: C1.2 22.67,8.28 X1.2 22.67,11.7 21.72,12.65
OSC_OUT: length 6.5
  Top Layer w0.254: C2.2 26.54,12.15 X1.1 22.93,12.15 U1.6
RST: length 22.2
  Top Layer w0.254: v1(20.56,14.71) 21.11,14.16 21.62,14.16 22.43,13.36 ; CN5.1 15.22,3 v1(15.22,4.81)
  Bottom Layer w0.254: v1(15.22,4.81) 15.22,7.86 21.06,13.7 21.06,14.21 v1(20.56,14.71) 19.92,15.35 R1.1 18.32,18.15 C3.2
SPI_MISO: length 5.3
  Top Layer w0.254: CN6.2 16.98,23.97 16.75,23.73 16.75,21.16 U1.27
SPI_MOSI: length 5.7
  Top Layer w0.254: U1.28 16.18,21.02 CN6.1
SPI_NSS: length 4.7
  Top Layer w0.254: CN6.4 18.58,23.92 17.76,23.1 17.76,21.56 U1.25
SPI_SCK: length 5
  Top Layer w0.254: CN6.3 17.76,24.92 17.76,23.86 17.31,23.4 17.31,21.31 U1.26
SWCLK: length 14.3
  Top Layer w0.254: CN5.2 14.46,4.81 11.92,7.35 11.92,12.47 U1.37
SWDIO: length 18.7
  Top Layer w0.254: U1.34 14.68,18.28 14.22,18.28 11.41,15.47 11.41,7.09 13.66,4.85 CN5.3
$1N1736: length 1.8
  Bottom Layer w0.254: U6.1 4.74,11.26 C11.2
$1N1740: length 3.4
  Bottom Layer w0.254: U6.2 5.84,12.16 6.21,11.79 6.21,9.82 C11.1
$1N1864: length 4.7
  Bottom Layer w0.254: C12.2 7.92,10.59 5.7,12.81 U6.3
$1N2389: length 4.8
  Bottom Layer w0.254: 10.72,19.96 9.85,19.96 9.51,20.3 9.51,21.56 R7.1 11.02,23.08 R6.1
$1N2553: length 6.4
  Bottom Layer w0.254: R6.2 8.87,23.1 8.62,22.84 8.62,19.79 9.11,19.31 U6.16
$1N2568: length 4.6
  Bottom Layer w0.254: R7.2 11.67,21.57 11.92,21.32 11.92,19.03 11.54,18.66 U6.17
$1N10555: length 1.5
  Top Layer w0.254: 15.19,21.21 15.19,22.69 LED1.2
$1N10742: length 1.5
  Top Layer w0.254: 10.43,21.19 10.43,22.69 R5.2
$1N10752: length 2
  Top Layer w0.254: R8.2 27.16,18.19 27.16,19.53 LED3.2

## Copper pours and planes (outline as drawn; the poured copper is in the pictures)
GND on Bottom Layer: 28.88,14.85 28.84,15.61 28.76,16.37 28.64,17.12 28.48,17.86 28.28,18.6 28.05,19.32 27.78,20.03 27.47,20.72 27.12,21.4 26.74,22.06 26.33,22.7 25.88,23.31 25.4,23.91 24.89,24.47 24.35,25.01 23.79,25.52 23.2,26 22.58,26.44 21.94,26.86 21.29,27.24 20.61,27.58 19.91,27.89 19.2,28.17 18.48,28.4 17.75,28.6 17,28.76 16.25,28.87 15.49,28.95 14.73,28.99 13.97,28.99 13.21,28.95 12.46,28.87 11.71,28.76 10.96,28.6 10.23,28.4 9.5,28.17 8.79,27.89 8.1,27.58 7.42,27.24 6.76,26.86 6.12,26.44 5.51,26 4.92,25.52 4.35,25.01 3.81,24.47 3.31,23.91 2.83,23.31 2.38,22.7 1.97,22.06 1.59,21.4 1.24,20.72 0.93,20.03 0.66,19.32 0.42,18.6 0.23,17.86 0.07,17.12 -0.05,16.37 -0.13,15.61 -0.17,14.85 -0.17,14.09 -0.13,13.33 -0.05,12.57 0.07,11.82 0.23,11.08 0.42,10.34 0.66,9.62 0.93,8.91 1.24,8.22 1.59,7.54 1.97,6.88 2.38,6.24 2.83,5.63 3.31,5.03 3.81,4.47 4.35,3.93 4.92,3.42 5.51,2.94 6.12,2.5 6.76,2.08 7.42,1.7 8.1,1.36 8.79,1.05 9.5,0.77 10.23,0.54 10.96,0.34 11.71,0.18 12.46,0.07 13.21,-0.01 13.97,-0.05 14.73,-0.05 15.49,-0.01 16.25,0.07 17,0.18 17.75,0.34 18.48,0.54 19.2,0.77 19.91,1.05 20.61,1.36 21.29,1.7 21.94,2.08 22.58,2.5 23.2,2.94 23.79,3.42 24.35,3.93 24.89,4.47 25.4,5.03 25.88,5.63 26.33,6.24 26.74,6.88 27.12,7.54 27.47,8.22 27.78,8.91 28.05,9.62 28.28,10.34 28.48,11.08 28.64,11.82 28.76,12.57 28.84,13.33 28.88,14.09
